# Altium project Diffusor.PrjPcb
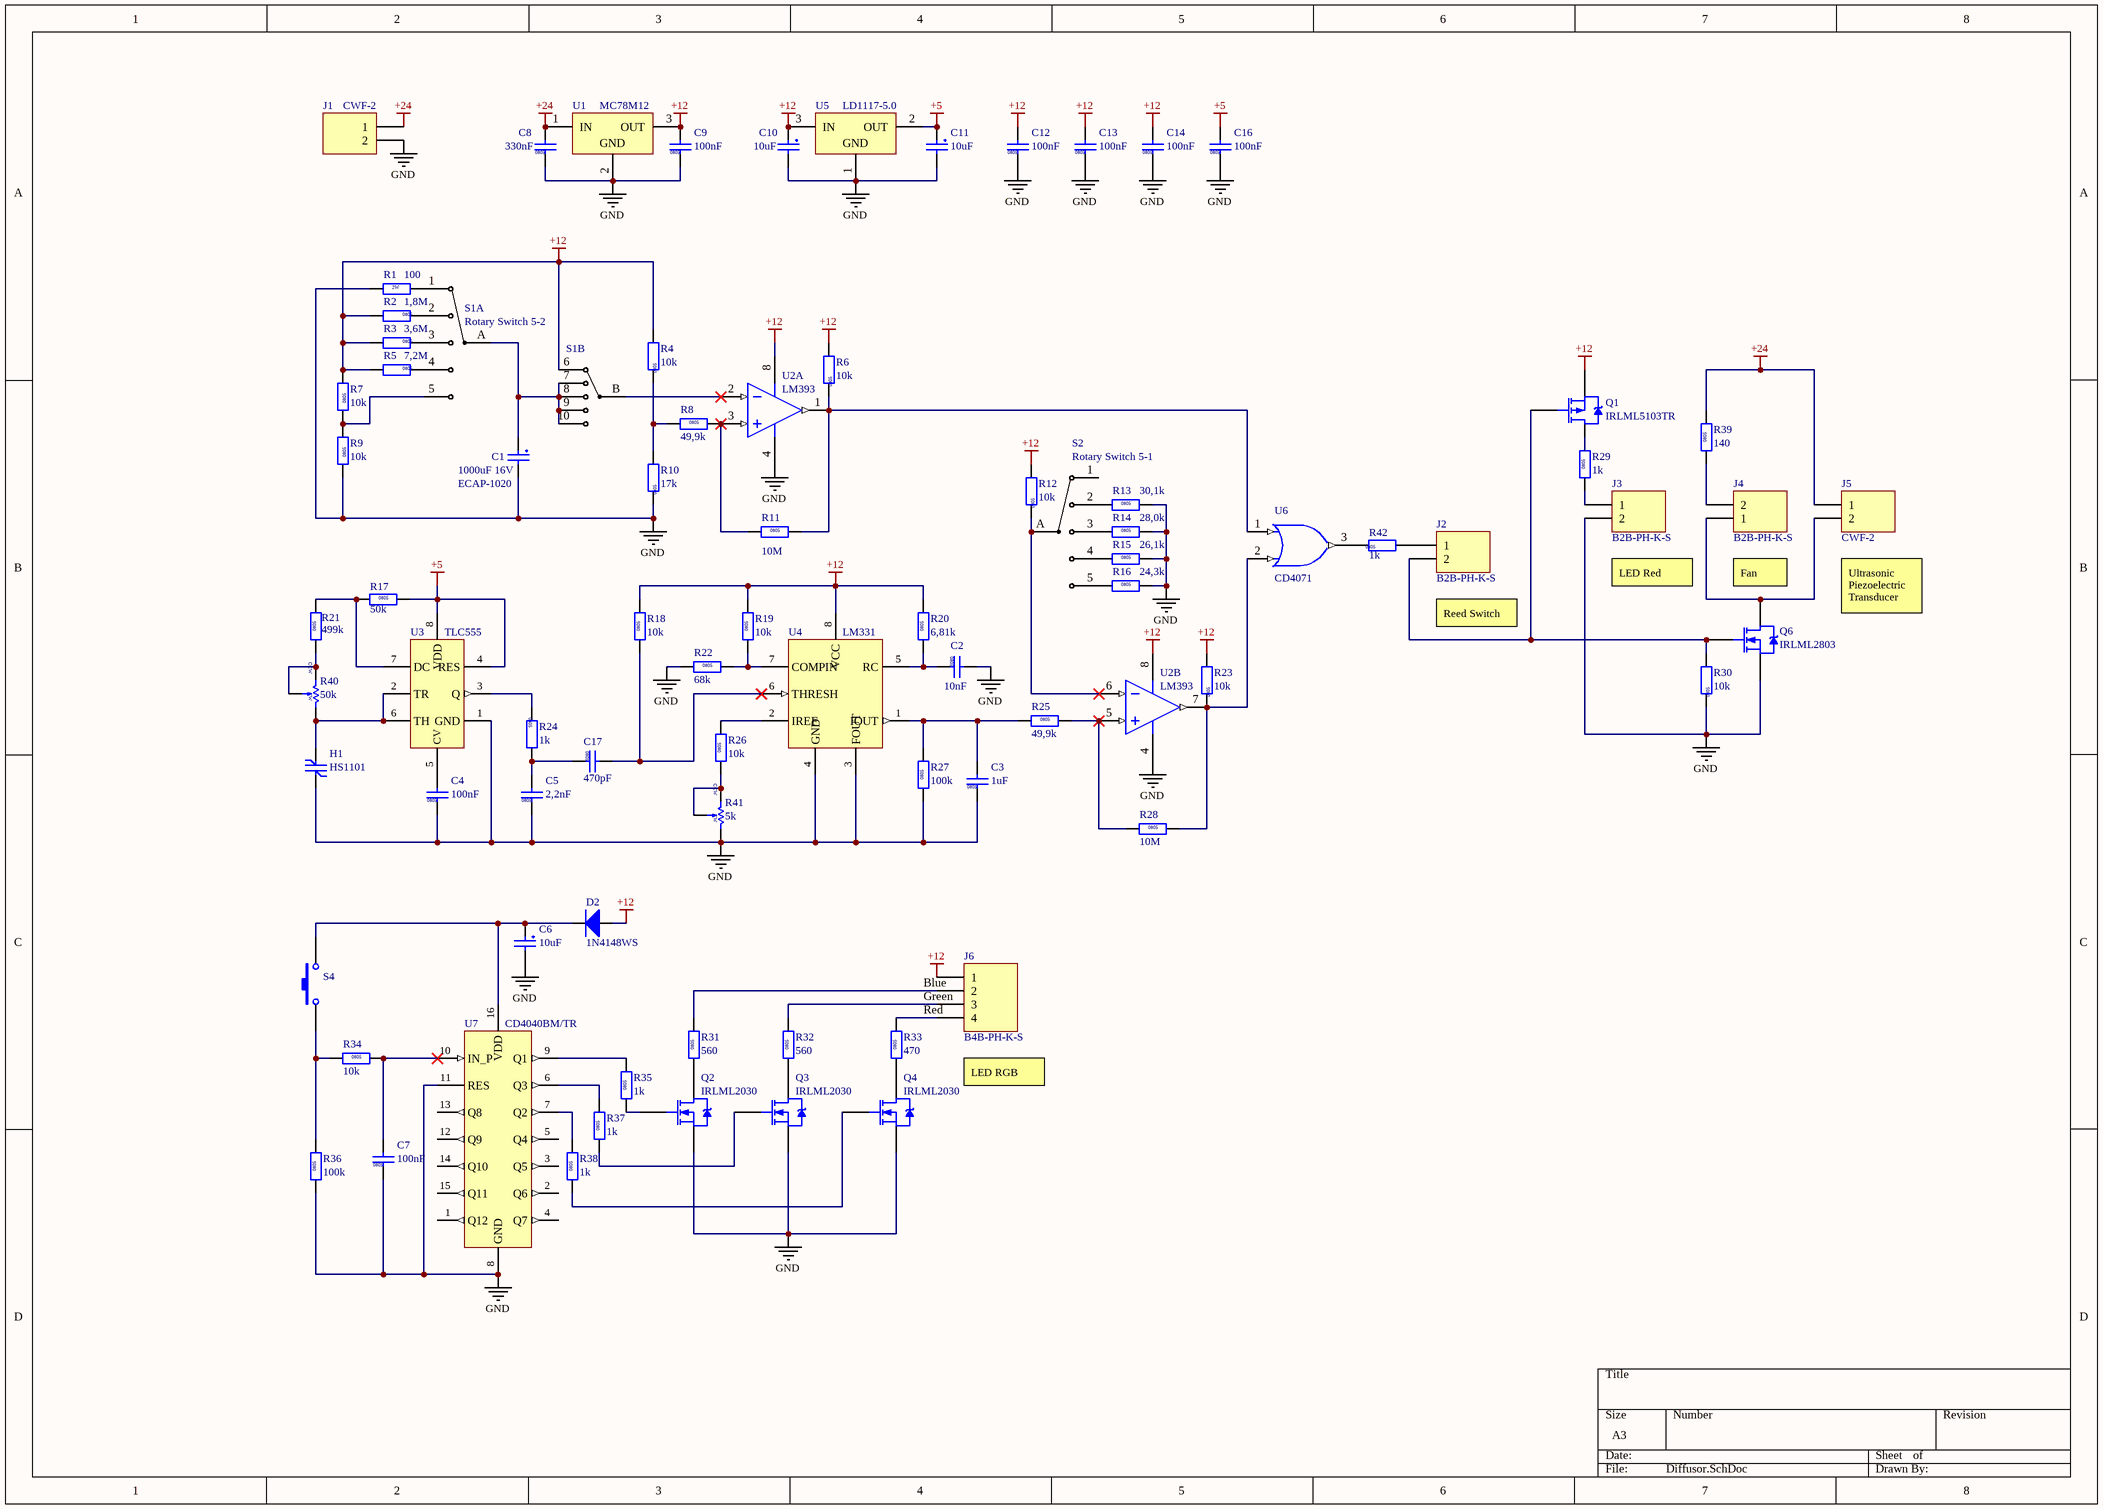
[diagram p0: Diffusor.SchDoc]
1 sheet, 81 parts. Net scope: global (net labels, ports and power ports of the same name join across sheets).
Board file: Diffusor_1.3.PcbDoc

## Sheet Diffusor.SchDoc
size A3; SheetNumber: 1; SheetTotal: 1

### Parts
C1  ECAP-1020  value 1000uF 16V  [ecap1020]
C2  value 10nF  [CAPC2012-0805M]  (hidden comment: CAPC_0805)
C3  value 1uF  [CAPC2012-0805M]  (hidden comment: CAPC_0805)
C4  value 100nF  [CAPC2012-0805M]  (hidden comment: CAPC_0805)
C5  value 2,2nF  [CAPC2012-0805M]  (hidden comment: CAPC_0805)
C6  value 10uF  [TCAPC_A_M]  (hidden comment: TCAPC_A)
C7  value 100nF  [CAPC2012-0805M]  (hidden comment: CAPC_0805)
C8  value 330nF  [CAPC2012-0805M]  (hidden comment: CAPC_0805)
C9  value 100nF  [CAPC2012-0805M]  (hidden comment: CAPC_0805)
C10  value 10uF  [TCAPC_A_M]  (hidden comment: TCAPC_A)
C11  value 10uF  [TCAPC_A_M]  (hidden comment: TCAPC_A)
C12  value 100nF  [CAPC2012-0805M]  (hidden comment: CAPC_0805)
C13  value 100nF  [CAPC2012-0805M]  (hidden comment: CAPC_0805)
C14  value 100nF  [CAPC2012-0805M]  (hidden comment: CAPC_0805)
C16  value 100nF  [CAPC2012-0805M]  (hidden comment: CAPC_0805)
C17  value 470pF  [CAPC2012-0805M]  (hidden comment: CAPC_0805)
D2  1N4148WS  [SOD323_M]
H1  HS1101  [B2B-PH-K-S]
J1  CWF-2  [CWF-2]
J2  B2B-PH-K-S  [B2B-PH-K-S]
J3  B2B-PH-K-S  [B2B-PH-K-S]
J4  B2B-PH-K-S  [B2B-PH-K-S]
J5  CWF-2  [CWF-2]
J6  B4B-PH-K-S  [B4B-PH-K-S]
Q1  IRLML5103TR  [SOT23-3M]
Q2  IRLML2030  [SOT23-3M]
Q3  IRLML2030  [SOT23-3M]
Q4  IRLML2030  [SOT23-3M]
Q6  IRLML2803  [SOT23-3M]
R1  value 100  [KNP200]  (hidden comment: RES_KNP200_R)
R2  value 1,8M  [RESC2012-0805M]  (hidden comment: RESC_0805_R)
R3  value 3,6M  [RESC2012-0805M]  (hidden comment: RESC_0805_R)
R4  value 10k  [RESC2012-0805M]  (hidden comment: RESC_0805_R)
R5  value 7,2M  [RESC2012-0805M]  (hidden comment: RESC_0805_R)
R6  value 10k  [RESC2012-0805M]  (hidden comment: RESC_0805_R)
R7  value 10k  [RESC2012-0805M]  (hidden comment: RESC_0805_R)
R8  value 49,9k  [RESC2012-0805M]  (hidden comment: RESC_0805_R)
R9  value 10k  [RESC2012-0805M]  (hidden comment: RESC_0805_R)
R10  value 17k  [RESC2012-0805M]  (hidden comment: RESC_0805_R)
R11  value 10M  [RESC2012-0805M]  (hidden comment: RESC_0805_R)
R12  value 10k  [RESC2012-0805M]  (hidden comment: RESC_0805_R)
R13  value 30,1k  [RESC2012-0805M]  (hidden comment: RESC_0805_R)
R14  value 28,0k  [RESC2012-0805M]  (hidden comment: RESC_0805_R)
R15  value 26,1k  [RESC2012-0805M]  (hidden comment: RESC_0805_R)
R16  value 24,3k  [RESC2012-0805M]  (hidden comment: RESC_0805_R)
R17  value 50k  [RESC2012-0805M]  (hidden comment: RESC_0805_R)
R18  value 10k  [RESC2012-0805M]  (hidden comment: RESC_0805_R)
R19  value 10k  [RESC2012-0805M]  (hidden comment: RESC_0805_R)
R20  value 6,81k  [RESC2012-0805M]  (hidden comment: RESC_0805_R)
R21  value 499k  [RESC2012-0805M]  (hidden comment: RESC_0805_R)
R22  value 68k  [RESC2012-0805M]  (hidden comment: RESC_0805_R)
R23  value 10k  [RESC2012-0805M]  (hidden comment: RESC_0805_R)
R24  value 1k  [RESC2012-0805M]  (hidden comment: RESC_0805_R)
R25  value 49,9k  [RESC2012-0805M]  (hidden comment: RESC_0805_R)
R26  value 10k  [RESC2012-0805M]  (hidden comment: RESC_0805_R)
R27  value 100k  [RESC2012-0805M]  (hidden comment: RESC_0805_R)
R28  value 10M  [RESC2012-0805M]  (hidden comment: RESC_0805_R)
R29  value 1k  [RESC2012-0805M]  (hidden comment: RESC_0805_R)
R30  value 10k  [RESC2012-0805M]  (hidden comment: RESC_0805_R)
R31  value 560  [RESC2012-0805M]  (hidden comment: RESC_0805_R)
R32  value 560  [RESC2012-0805M]  (hidden comment: RESC_0805_R)
R33  value 470  [RESC2012-0805M]  (hidden comment: RESC_0805_R)
R34  value 10k  [RESC2012-0805M]  (hidden comment: RESC_0805_R)
R35  value 1k  [RESC2012-0805M]  (hidden comment: RESC_0805_R)
R36  value 100k  [RESC2012-0805M]  (hidden comment: RESC_0805_R)
R37  value 1k  [RESC2012-0805M]  (hidden comment: RESC_0805_R)
R38  value 1k  [RESC2012-0805M]  (hidden comment: RESC_0805_R)
R39  value 140  [RESC2012-0805M]  (hidden comment: RESC_0805_R)
R40  value 50k  [Trim_3296W]  (hidden comment: Trim_3296W)
R41  value 5k  [Trim_3296W]  (hidden comment: Trim_3296W)
R42  value 1k  [RESC2012-0805M]  (hidden comment: RESC_0805_R)
S1  Rotary Switch 5-2  [B12B-PHDSS 2mm 2х6pin]  (parts A,B of 2)
S2  Rotary Switch 5-1  [B6B for rotary switch]
S4  Switch  [B2B-PH-K-S]  (value not drawn)
U1  MC78M12  [MC78M12CDTG_DPAK]
U2  LM393  [SOIC127P600-8N]  (parts A,B of 2)
U3  TLC555  [TLC555]
U4  LM331  [LM331 DIP8]
U5  LD1117-5.0  [SOT230P700X165-4N]
U6  CD4071  [CD4071_SOIC14]
U7  CD4040BM/TR  [CD4040BM/TR_TSOP16]

### Nets
+5: C11.1 C16.2 R17.2 U3.4(RES) U3.8(VDD) U5.2(OUT)
+12: C9.2 C10.1 C12.2 C13.2 C14.2 D2.2(A) J6.1 Q1.2(S) R2.2 R3.2 R4.2 R5.2 R6.2 R7.1 R12.2 R18.2 R19.2 R20.2 R23.2 S1.6 U1.3(OUT) U2.8(V+) U4.8(VCC) U5.3(IN)
+24: C8.2 J1.1 J5.1 R39.2 U1.1(IN)
GND: C1.2 C2.2 C3.1 C4.1 C5.1 C6.2 C7.1 C8.1 C9.1 C10.2 C11.2 C12.1 C13.1 C14.1 C16.1 H1.2(GND) J1.2 J3.2 Q2.2(S) Q3.2(S) Q4.2(S) Q6.2(S) R1.1 R9.2 R10.1 R13.2 R14.2 R15.2 R16.2 R22.1 R27.1 R30.1 R36.1 R41.3 U1.2(GND) U2.4(GND) U3.1(GND) U4.3(FOUT) U4.4(GND) U5.1(GND) U7.8(GND) U7.11(RES)
Blue: J6.2 R31.2
Green: J6.3 R32.2
Red: J6.4 R33.2
NetC1_1: C1.1 S1.7 S1.8 S1.9 S1.10 S1.A
NetC2_1: C2.1 R20.1 U4.5(RC)
NetC3_2: C3.2 R25.1 R27.2 U4.1(IOUT)
NetC4_2: C4.2 U3.5(CV)
NetC5_2: C5.2 C17.1 R24.2
NetC6_1: C6.1 D2.1(K) S4.1 U7.16(VDD)
NetC7_2: C7.2 R34.2 U7.10(IN_P)
NetC17_2: C17.2 R18.1 U4.6(THRESH)
NetH1_1: H1.1 R40.3 U3.2(TR) U3.6(TH)
NetJ2_1: J2.1 R42.2
NetJ2_2: J2.2 Q1.1(G) Q6.1(G) R30.2
NetJ3_1: J3.1 R29.1
NetJ4_1: J4.1 J5.2 Q6.3(D)
NetJ4_2: J4.2 R39.1
NetQ1_3: Q1.3(D) R29.2
NetQ2_1: Q2.1(G) R35.1
NetQ2_3: Q2.3(D) R31.1
NetQ3_1: Q3.1(G) R37.1
NetQ3_3: Q3.3(D) R32.1
NetQ4_1: Q4.1(G) R38.1
NetQ4_3: Q4.3(D) R33.1
NetR1_2: R1.2 S1.1
NetR2_1: R2.1 S1.2
NetR3_1: R3.1 S1.3
NetR4_1: R4.1 R8.1 R10.2
NetR5_1: R5.1 S1.4
NetR6_1: R6.1 R11.2 U2.1(OUT) U6.1(IN_A)
NetR7_2: R7.2 R9.1 S1.5
NetR8_2: R8.2 R11.1 U2.3(IN+)
NetR12_1: R12.1 S2.A U2.6(IN-)
NetR13_1: R13.1 S2.2
NetR14_1: R14.1 S2.3
NetR15_1: R15.1 S2.4
NetR16_1: R16.1 S2.5
NetR17_1: R17.1 R21.2 U3.7(DC)
NetR19_1: R19.1 R22.2 U4.7(COMPIN)
NetR21_1: R21.1 R40.1 R40.2
NetR23_1: R23.1 R28.2 U2.7(OUT) U6.2(IN_B)
NetR24_1: R24.1 U3.3(Q)
NetR25_2: R25.2 R28.1 U2.5(IN+)
NetR26_1: R26.1 R41.1 R41.2
NetR26_2: R26.2 U4.2(IREF)
NetR34_1: R34.1 R36.2 S4.2
NetR35_2: R35.2 U7.9(Q1)
NetR37_2: R37.2 U7.6(Q3)
NetR38_2: R38.2 U7.7(Q2)
NetR42_1: R42.1 U6.3(OUT_J)
NetS1_B: S1.B U2.2(IN-)

Not connected (* = marked no-connect by the designer): S2 1; U6 7(GND) 14(VCC); U7 1(Q12) 2(Q6) 3(Q5) 4(Q7) 5(Q4) 12(Q9) 13(Q8) 14(Q10) 15(Q11)

### Notes on the sheet
- LED Red
- Fan
- (near J2) Reed Switch
- (near J5) Ultrasonic
  Piezoelectric
  Transducer
- (near J6) LED RGB
- (in symbol CAPC_0805) 0805
- (in symbol RES_KNP200_R) 2W
- (in symbol RESC_0805_R) 0805
- (in symbol Trim_3296W) CCW; CW

### Library data of the parts
C1 = ECAP-1020: Capacitor electrolytic 5 mm pitch, 10*20 body 5pitch
C2-C5 C7-C9 C12-C14 C16 C17 = CAPC_0805: Capacitor 0805
C6 C10 C11 = TCAPC_A: Capacitor tantalum SMD type A
D2 = 1N4148WS: 1N4148WS switching Si diode
J2-J4 = B2B-PH-K-S: B2B-PH-K-S 2.0 mm pitrch header PCB straight
J6 = B4B-PH-K-S: B2B-PH-K-S 2.0 mm pitrch header PCB straight
Q1 = IRLML6402
Q2-Q4 = IRLML2030: IRLML2030 Hexfet power MOSFET
Q6 = IRLML2803: HEXFET Power MOSFET; Published: 8-Jun-2000; LatestRevisionDate: 20-Nov-2009; LatestRevisionNote: IPC-7351 Footprint Added.; DatasheetVersion: Aug-1997; PackageReference: SOT-23; Publisher: Altium Limited; PackageDescription: 3-Pin SOT-23 Package 0.95 mm Pitch, 2.3 mm Lead Span; ComponentLink1Description: Manufacturer Link; ComponentLink1URL: http://www.irf.com/; ComponentLink2Description: Datasheet; ComponentLink2URL: http://www.irf.com/product-info/datasheets/data/irlml2803.pdf
R1 = RES_KNP200_R: Resistor THT axial KNP200 2W
R2-R39 R42 = RESC_0805_R: Resistor 0805
R40 R41 = Trim_3296W: Trimming resistor multinurn Bourns series 3296W
U1 U5 = MC78M12CDTG: Linear Regulator; PartNumber: LM1117T-5.0; Manufacturer: National Semiconductor; CompType: LDO IC; PackageTopMarking: NSUZXYTTE#*LM1117T*5.0; PowerWise: N; Published: 4-Dec-2008; DatasheetVersion: Apr-2006; PackageVersion: revL, Jan-1992; PackageReference: T03B; Publisher: Altium Limited; PackageDescription: TO-220, Molded, 3 Lead, Straight; RoHS: O; PinCount: 3; DigiKeyPartNumber: LM1117T-5.0-ND; ComponentLink1Description: LM1117 Datasheet; ComponentLink1URL: http://www.national.com/ds/LM/LM1117.pdf; ComponentLink2Description: LM1117 Web Page; ComponentLink2URL: http://www.national.com/pf/LM/LM1117.html; ComponentLink3Description: T03B Package Page; ComponentLink3URL: http://www.national.com/packaging/folders/t03b.html
U2 = LM393/293/2903: Low-Power Low Offset Voltage Dual Comparator
U6 = CD4071: 2-Input OR Gate; Published: 10-Feb-2010; DatasheetVersion: Rev.5.00, Jan-2004; PackageVersion: Jan-2005; PackageReference: PTSP0005ZC-A; Publisher: Altium Limited; PackageDescription: 5-Pin Plastic SOT-353 Package 0.65 mm Pitch, 2.1 mm Lead Span; Code_JEITA: SC-88A; Code_IPC: SOT353-5; ComponentLink1Description: Manufacturer Link; ComponentLink1URL: http://sg.renesas.com/fmwk.jsp?cnt=unilogic_hc_root.jsp&fp=/products/standard_ic/general_purpose_logic/uni_logic/unilogic_hc/; ComponentLink2Description: Datasheet; ComponentLink2URL: http://documentation.renesas.com/eng/products/logic/rej03d0187_hd74hc1g32.pdf; ComponentLink3Description: Packaging Specification; ComponentLink3URL: http://sg.renesas.com/media/products/common_info/package/pdf/ic/code/ptsp0005zc_a.pdf
S4 = Switch: Published: 24-Mar-1999; LatestRevisionDate: 17-Jul-2002; LatestRevisionNote: Re-released for DXP Platform.; PackageReference: SPST-2; Publisher: Altium Limited